# EAGLE design MultiPSU (EAGLE 7.6.0)
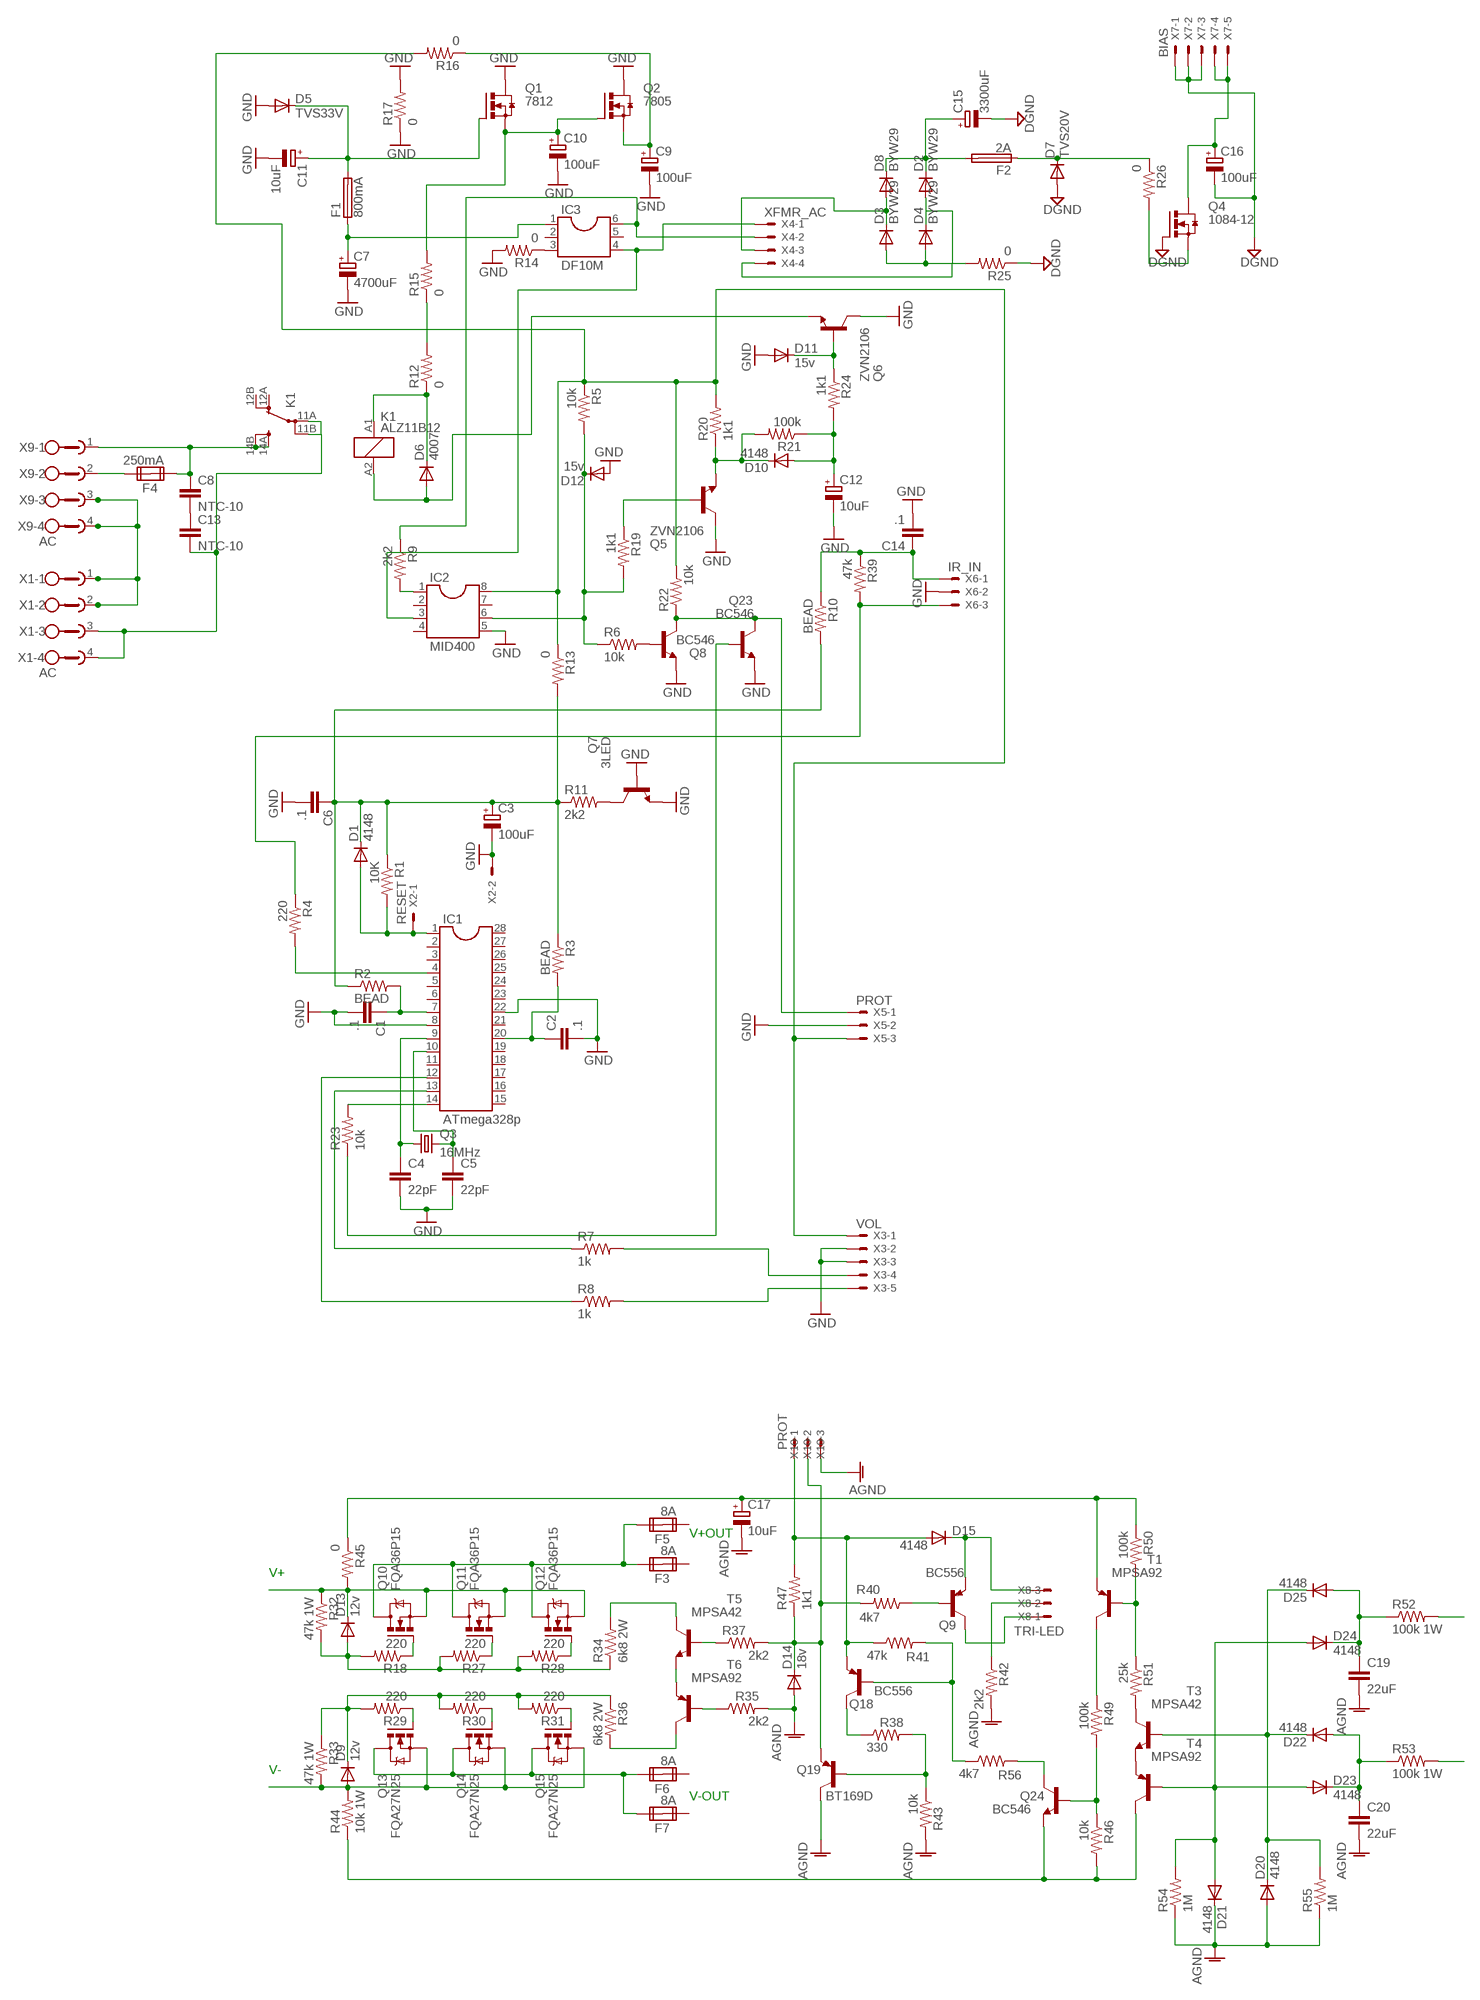
[diagram p0: schematic, sheet 1]

## Parts
C1  .1  C-EUC1210K  [C1210K]
C2  .1  C-EUC1210K  [C1210K]
C3  100uF  CPOL-EUE3.5-10  [E3,5-10]
C4  22pF  C-EUC1210K  [C1210K]
C5  22pF  C-EUC1210K  [C1210K]
C6  .1  C-EUC1210K  [C1210K]
C7  4700uF  CPOL-EUE7.5-16  [E7,5-16]
C8  NTC-10  C-EU102-054X133  [C102-054X133]
C9  100uF  CPOL-EUE3.5-10  [E3,5-10]
C10  100uF  CPOL-EUE3.5-10  [E3,5-10]
C11  10uF  CPOL-EUE3.5-10  [E3,5-10]
C12  10uF  CPOL-EUE3.5-10  [E3,5-10]
C13  NTC-10  C-EU102-054X133  [C102-054X133]
C14  .1  C-EUC1210K  [C1210K]
C15  3300uF  CPOL-EUE7.5-16  [E7,5-16]
C16  100uF  CPOL-EUE3.5-10  [E3,5-10]
C17  10uF  CPOL-EUE3.5-10  [E3,5-10]
C19  22uF  C-EU050-075X075  [C050-075X075]
C20  22uF  C-EU050-075X075  [C050-075X075]
D1  4148  1N4148DO35-7  [DO35-7]
D2  BYW29  [DO220S]
D3  BYW29  [DO220S]
D4  BYW29  [DO220S]
D5  TVS33V  BY448  [SOD57-10]
D6  4007  1N4004  [DO41-10]
D7  TVS20V  BY448  [SOD57-10]
D8  BYW29  [DO220S]
D9  12v  1N4004  [DO41-10]
D10  4148  1N4148DO35-10  [DO35-10]
D11  15v  1N4148DO35-7  [DO35-7]
D12  15v  1N4148DO35-7  [DO35-7]
D13  12v  1N4004  [DO41-10]
D14  18v  1N4004  [DO41-10]
D15  4148  1N4004  [DO41-10]
D20  4148  1N4148DO35-7  [DO35-7]
D21  4148  1N4148DO35-7  [DO35-7]
D22  4148  1N4148DO35-7  [DO35-7]
D23  4148  1N4148DO35-7  [DO35-7]
D24  4148  1N4148DO35-7  [DO35-7]
D25  4148  1N4148DO35-7  [DO35-7]
F1  800mA  19560  [19560]
F2  2A  19560  [19560]
F3  8A  FUSE2P  [FUSE1]
F4  250mA  FUSE2P  [FUSE1]
F5  8A  FUSE2P  [FUSE1]
F6  8A  FUSE2P  [FUSE1]
F7  8A  FUSE2P  [FUSE1]
IC1  ATmega328p  DIL28-3  [DIL28-3]
IC2  MID400  DIL8  [DIL08]
IC3  DF10M  DIL6  [DIL06]
K1  ALZ11B12  RT314730  [RT-C/O16A5]
Q1  7812  IRFI540NPBF  [TO220BH]
Q2  7805  IRFI540NPBF  [TO220BH]
Q3  16MHz  CRYSTALHC49S  [HC49/S]
Q4  1084-12  IRFI540NPBF  [TO220BH]
Q5  ZVN2106  BC550B  [TO92-EBC]
Q6  ZVN2106  BC550B  [TO92-EBC]
Q7  3LED  BC546A  [TO92-EBC]
Q8  BC546  BC550B  [TO92-EBC]
Q9  BC556  BC560  [TO92-EBC]
Q10  FQA36P15  IXFH_6N100  [TO-247AD-H]
Q11  FQA36P15  IXFH_6N100  [TO-247AD-H]
Q12  FQA36P15  IXFH_6N100  [TO-247AD-H]
Q13  FQA27N25  IXFH_6N100  [TO-247AD-H]
Q14  FQA27N25  IXFH_6N100  [TO-247AD-H]
Q15  FQA27N25  IXFH_6N100  [TO-247AD-H]
Q18  BC556  BC560  [TO92-EBC]
Q19  BT169D  BC560  [TO92-EBC]
Q23  BC546  BC550B  [TO92-EBC]
Q24  BC546  BC550B  [TO92-EBC]
R1  10K  R-US_0309/10  [0309/10]
R2  BEAD  R-US_0309/10  [0309/10]
R3  BEAD  R-US_0309/12  [0309/12]
R4  220  R-US_0309/12  [0309/12]
R5  10k  R-US_0309/10  [0309/10]
R6  10k  R-US_0309/12  [0309/12]
R7  1k  R-US_R1210  [R1210]
R8  1k  R-US_R1210  [R1210]
R9  2k2  R-US_0309/12  [0309/12]
R10  BEAD  R-US_0309/10  [0309/10]
R11  2k2  R-US_0309/10  [0309/10]
R12  0  R-US_0309/10  [0309/10]
R13  0  R-US_0309/12  [0309/12]
R14  0  R-US_0309/10  [0309/10]
R15  0  R-US_0309/12  [0309/12]
R16  0  R-US_0309/12  [0309/12]
R17  0  R-US_0309/12  [0309/12]
R18  220  R-US_0309/12  [0309/12]
R19  1k1  R-US_0309/12  [0309/12]
R20  1k1  R-US_0309/10  [0309/10]
R21  100k  R-US_0309/10  [0309/10]
R22  10k  R-US_0309/10  [0309/10]
R23  10k  R-US_R1210  [R1210]
R24  1k1  R-US_0309/10  [0309/10]
R25  0  R-US_0309/12  [0309/12]
R26  0  R-US_0309/12  [0309/12]
R27  220  R-US_0309/12  [0309/12]
R28  220  R-US_0309/12  [0309/12]
R29  220  R-US_0309/12  [0309/12]
R30  220  R-US_0309/12  [0309/12]
R31  220  R-US_0309/12  [0309/12]
R32  47k 1W  R-US_0411/15  [0411/15]
R33  47k 1W  R-US_0411/15  [0411/15]
R34  6k8 2W  R-US_0411/15  [0411/15]
R35  2k2  R-US_0309/10  [0309/10]
R36  6k8 2W  R-US_0411/15  [0411/15]
R37  2k2  R-US_0309/10  [0309/10]
R38  330  R-US_0309/10  [0309/10]
R39  47k  R-US_0309/10  [0309/10]
R40  4k7  R-US_0309/10  [0309/10]
R41  47k  R-US_0309/10  [0309/10]
R42  2k2  R-US_0309/10  [0309/10]
R43  10k  R-US_0309/10  [0309/10]
R44  10k 1W  R-US_0411/15  [0411/15]
R45  0  R-US_0309/12  [0309/12]
R46  10k  R-US_0411/15  [0411/15]
R47  1k1  R-US_0309/10  [0309/10]
R49  100k  R-US_0411/15  [0411/15]
R50  100k  R-US_0309/10  [0309/10]
R51  25k  R-US_0309/10  [0309/10]
R52  100k 1W  R-US_0309/10  [0309/10]
R53  100k 1W  R-US_0309/10  [0309/10]
R54  1M  R-US_R1210  [R1210]
R55  1M  R-US_R1210  [R1210]
R56  4k7  R-US_0309/10  [0309/10]
T1  MPSA92  MPSA92-PNP-TO92-EBC  [TO92-EBC]
T3  MPSA42  MPSA42-NPN-TO92-EBC  [TO92-EBC]
T4  MPSA92  MPSA92-PNP-TO92-EBC  [TO92-EBC]
T5  MPSA42  MPSA42-NPN-TO92-EBC  [TO92-EBC]
T6  MPSA92  MPSA92-PNP-TO92-EBC  [TO92-EBC]
X1  AC  GMSTBA4  [GMSTBA4]
X2  RESET  22-23-2021  [22-23-2021]
X3  VOL  22-23-2051  [22-23-2051]
X4  XFMR_AC  5566-4  [5566-4]
X5  PROT  22-23-2031  [22-23-2031]
X6  IR_IN  22-23-2031  [22-23-2031]
X7  BIAS  22-23-2051  [22-23-2051]
X8  TRI-LED  22-23-2031  [22-23-2031]
X9  AC  GMSTBA4  [GMSTBA4]
X10  PROT  22-23-2031  [22-23-2031]

## Nets
AGND: C17.- C19.2 C20.2 D14.A D20.A D21.C Q19.C R35.2 R42.2 R43.2 R54.1 R55.1 X10.3
DGND: C15.- C16.- D7.A Q4.G R25.1 X7.1 X7.2 X7.3
GND: C1.2 C2.2 C3.- C4.2 C5.2 C6.2 C7.- C9.- C10.- C11.- C12.- C14.2 D5.A D11.A D12.A IC1.8 IC1.22 IC2.5 Q1.D Q2.D Q5.C Q6.C Q7.B Q7.E Q8.E Q23.E R14.2 R17.1 R17.2 X2.2 X3.2 X3.3 X5.2 X6.2
N$1: Q8.B R6.2
N$2: D1.A IC1.1 R1.2 X2.1
N$3: IC1.4 R4.2
N$4: C2.1 IC1.20 R3.2
N$5: R4.1 R39.2 X6.3
N$7: IC1.13 R7.1
N$8: IC1.12 R8.1
N$9: C11.+ D5.C F1.2 Q1.G
N$10: C8.2 C13.1
N$11: D6.C K1.A1 R12.1
N$12: IC3.6 R9.1 X4.2
N$13: C4.1 IC1.9 Q3.1
N$14: C5.1 IC1.10 Q3.2
N$15: X1.1 X1.2 X9.3 X9.4
N$16: D12.C IC2.6 R5.2 R6.1 R19.2
N$17: IC2.1 R9.2
N$18: Q8.C Q23.C R22.1 X5.1
N$19: IC3.3 R14.1
N$20: C14.1 R10.1 R39.1 X6.1
N$21: F4.2A X9.2
N$22: Q7.C R11.2
N$24: C8.1 F4.1A K1.14A(2:SA) K1.14B(2:SB) X9.1
N$25: C13.2 K1.11A(2:PA) K1.11B(2:PB) X1.3 X1.4
N$26: C9.+ Q2.S R16.1
N$28: C10.+ Q1.S Q2.G R15.2
N$29: R12.2 R15.1
N$30: C7.+ F1.1 IC3.1
N$32: C3.+ C6.1 D1.C R1.1 R2.1 R3.1 R10.2 R11.1 R13.2
N$33: D3.C D8.A X4.3
N$34: D2.A D4.C X4.4
N$35: C1.1 IC1.7 R2.2
N$36: IC2.8 R5.1 R13.1 R16.2 R20.2 R22.2 X3.1 X5.3
N$37: IC2.3 IC3.4 X4.1
N$38: Q5.B R19.1
N$39: D10.C Q5.E R20.1 R21.2
N$40: C12.+ D10.A R21.1 R24.2
N$41: IC1.14 R23.2
N$42: D6.A K1.A2 Q6.E
N$43: D11.C Q6.B R24.1
N$44: Q23.B R23.1
N$45: R8.2 X3.5
N$46: R7.2 X3.4
N$47: D3.A D4.A R25.2
N$48: C15.+ D2.C D8.C F2.2
N$49: D7.C F2.1 R26.1
N$52: Q4.S R26.2
N$53: D13.C Q10.S Q11.S Q12.S R32.1 R45.2
N$54: F3.2A F5.2A Q10.D Q11.D Q12.D
N$55: D9.A Q13.S Q14.S Q15.S R33.2 R44.2
N$56: C16.+ Q4.D X7.4 X7.5
N$57: F6.2A F7.2A Q13.D Q14.D Q15.D
N$58: Q10.G R18.1
N$59: Q11.G R27.1
N$60: Q12.G R28.1
N$61: Q13.G R29.1
N$62: Q14.G R30.1
N$63: Q15.G R31.1
N$64: D9.C R29.2 R30.2 R31.2 R33.1 R36.1
N$65: D13.A R18.2 R27.2 R28.2 R32.2 R34.1
N$70: R34.2 T5.C
N$71: R36.2 T6.C
N$72: T5.E T6.E
N$73: R35.1 T6.B
N$74: R37.1 T5.B
N$75: Q18.C R38.1
N$76: D14.C Q19.E R37.2 R40.2 R47.1 X10.2
N$77: Q9.B R40.1
N$78: R42.1 X8.2
N$79: Q19.B R38.2 R43.1
N$80: Q9.C X8.1
N$81: D15.C Q9.E X8.3
N$89: Q24.E R44.1 R46.2 T4.C
N$90: R49.1 T1.C
N$91: Q24.B R46.1 R49.2
N$92: C17.+ R45.1 R50.1 T1.E
N$93: Q18.B R41.2 R56.1
N$94: R50.2 R51.1 T1.B
N$95: R51.2 T3.C
N$96: T3.E T4.E
N$98: D21.A D23.A D24.A R54.2 T4.B
N$99: D20.C D22.C D25.C R55.2 T3.B
N$100: C20.1 D22.A D23.C R53.1
N$101: C19.1 D24.C D25.A R52.1
N$103: R52.2
N$106: R53.2
N$108: Q24.C R56.2
N$109: D15.A Q18.E R41.1 R47.2 X10.1
Unconnected: F3.1A F3.1B F3.2B F4.1B F4.2B F5.1A F5.1B F5.2B F6.1A F6.1B F6.2B F7.1A F7.1B F7.2B IC1.2 IC1.3 IC1.5 IC1.6 IC1.11 IC1.15 IC1.16 IC1.17 IC1.18 IC1.19 IC1.21 IC1.23 IC1.24 IC1.25 IC1.26 IC1.27 IC1.28 IC2.2 IC2.4 IC2.7 IC3.2 IC3.5 K1.12A(2:OA) K1.12B(2:OB)

## Notes on the sheet
- V+OUT
- V+
- V-
- V-OUT

## Library data of the parts
C1 C2 C4-C6 C8 C13 C14 C19 C20 = resistor:C-EU: CAPACITOR, European symbol
C3 C7 C9-C12 C15-C17 = resistor:CPOL-EU: POLARIZED CAPACITOR, European symbol
D1 D10-D12 D20-D25 = diode:1N4148: DIODE high speed (Philips)
D2-D4 D8 = diode:BYW29: DIODE ultra fast rectifier, 200 V, 8 A
D5 D7 = diode:BY448: DIODE damper diode
D6 D9 D13-D15 = diode:1N4004: DIODE general purpose rectifier, 1 A
F1 F2 = fuse:19560: FUSE HOLDER TR5, Wickmann; MPN: 56000001009; OC_FARNELL: 1185363; OC_NEWARK: 15P8392
F3-F7 = special:FUSE2P: FUSE 5 x 20 mm
IC1 = ic-package:DIL28: Dual In Line
IC2 = ic-package:DIL8: Dual In Line / Socket
IC3 = ic-package:DIL6: Dual In Line / Socket
K1 = relay:RT31*: Power PCB Relayl SCHRACK 1 pole 12 / 16 A, DC- or AC-coi Source: http://www.schrack.com/.. 5819.pdf; MPN: RT314730; OC_FARNELL: 1629051; OC_NEWARK: 03P2424
Q1 Q2 Q4 = transistor-power:IRFI540NPBF: HEXFET Power MOISFET VDSS = 100V, RDS(on) = 0.052 Ohm, ID = 20A, VGS(th) = 2.0 -- 4.0V Source: http://www.irf.com/product-info/datasheets/data/irfi540npbf.pdf
Q3 = crystal:CRYSTAL: CRYSTAL; OC_FARNELL: 1667008; OC_NEWARK: unknown
Q5 Q6 Q8 Q23 Q24 = transistor-npn:BC550*: NPN Transistor
Q7 = transistor-npn:BC546*: NPN Transistor
Q9 Q18 Q19 = transistor-pnp:BC560*: PNP Transistror
Q10-Q15 = transistor-power:IXF?6N*: HiPerFET (TM) Power MOSFET N-Channel Enhancement Mode HDMOS Family Source: http://www.ixys.com/91529.pdf
R1-R47 R49-R56 = resistor:R-US_: RESISTOR, American symbol
T1 T4 T6 = transistor:*-PNP-: PNP Transistror
T3 T5 = transistor:*-NPN-: NPN Transistror BF959 corrected 2008.03.06
X1 X9 = con-phoenix-762:GMSTBA4: PHOENIX; MF: FARNELL; MPN: 1757268; OC_FARNELL: 3705195; OC_NEWARK: 71C4163
X2 = con-molex:22-23-2021: .100" (2.54mm) Center Header - 2 Pin; MF: MOLEX; MPN: 22-23-2021; OC_FARNELL: 1462926; OC_NEWARK: 25C3832
X3 X7 = con-molex:22-23-2051: .100" (2.54mm) Center Header - 5 Pin; MF: MOLEX; MPN: 22-23-2051; OC_FARNELL: 1462952; OC_NEWARK: 38C9178
X4 = con-molex:5566-4: Mini FIT connector 4 pol Source: http://www.molex.com; OC_FARNELL: unknown; OC_NEWARK: unknown
X5 X6 X8 X10 = con-molex:22-23-2031: .100" (2.54mm) Center Header - 3 Pin; MF: MOLEX; MPN: 22-23-2031; OC_FARNELL: 1462950; OC_NEWARK: 30C0862

## Board
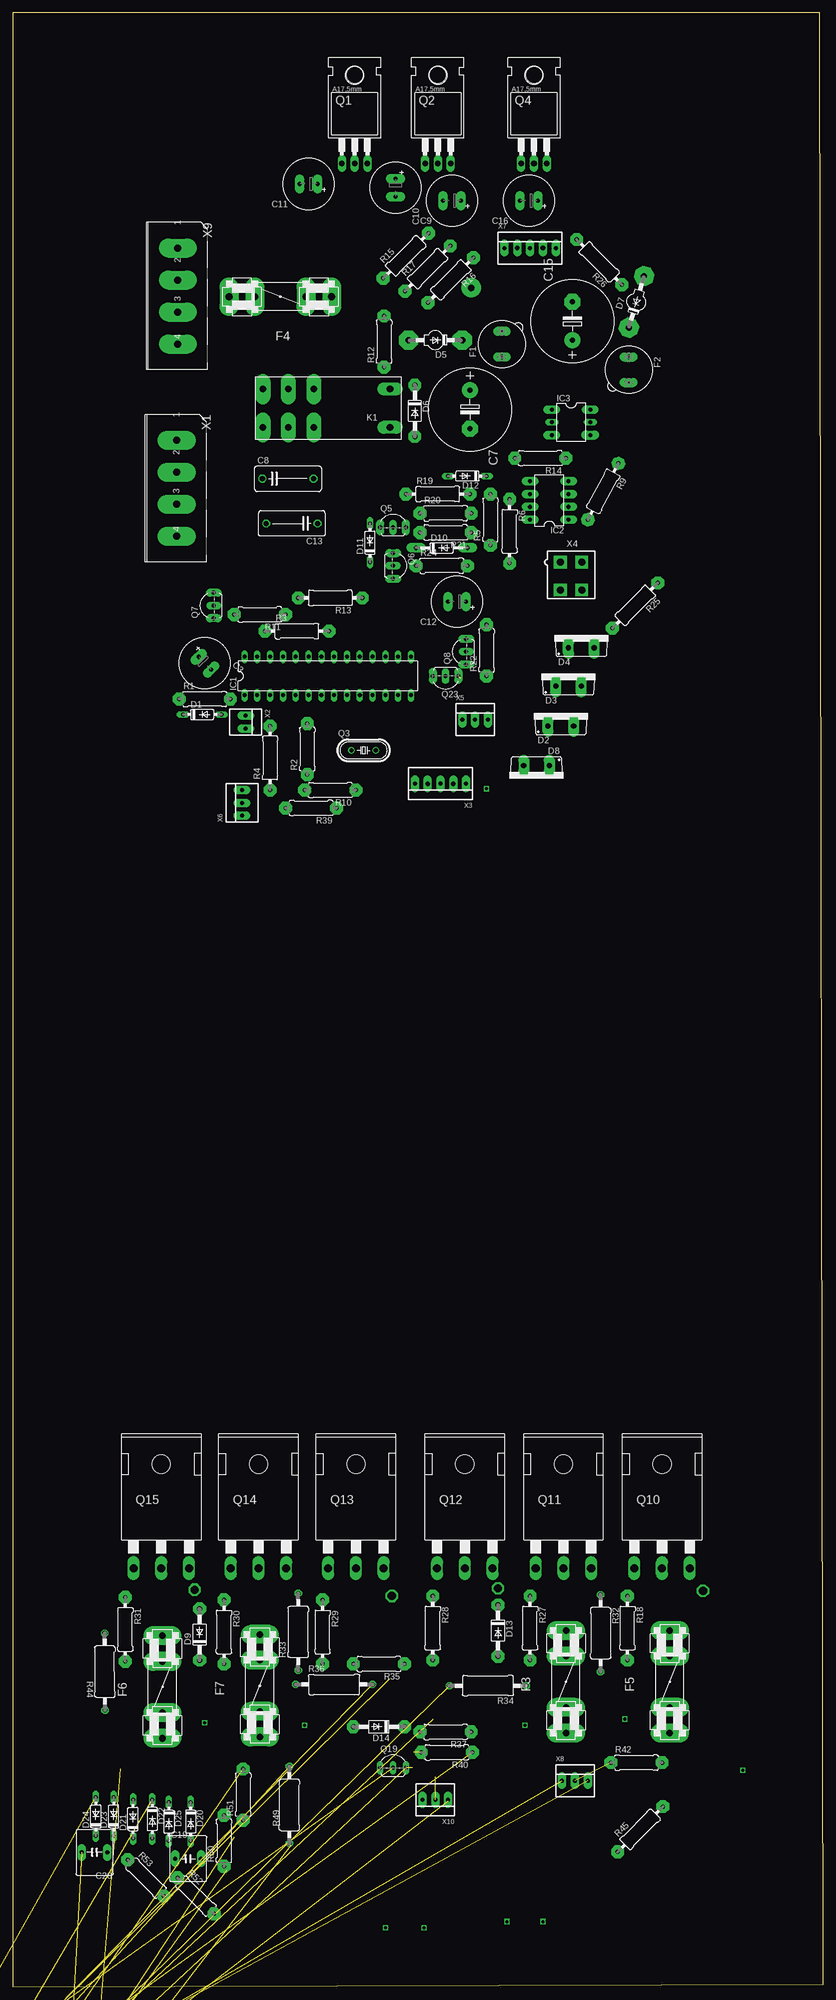
[diagram p1: board, top side]
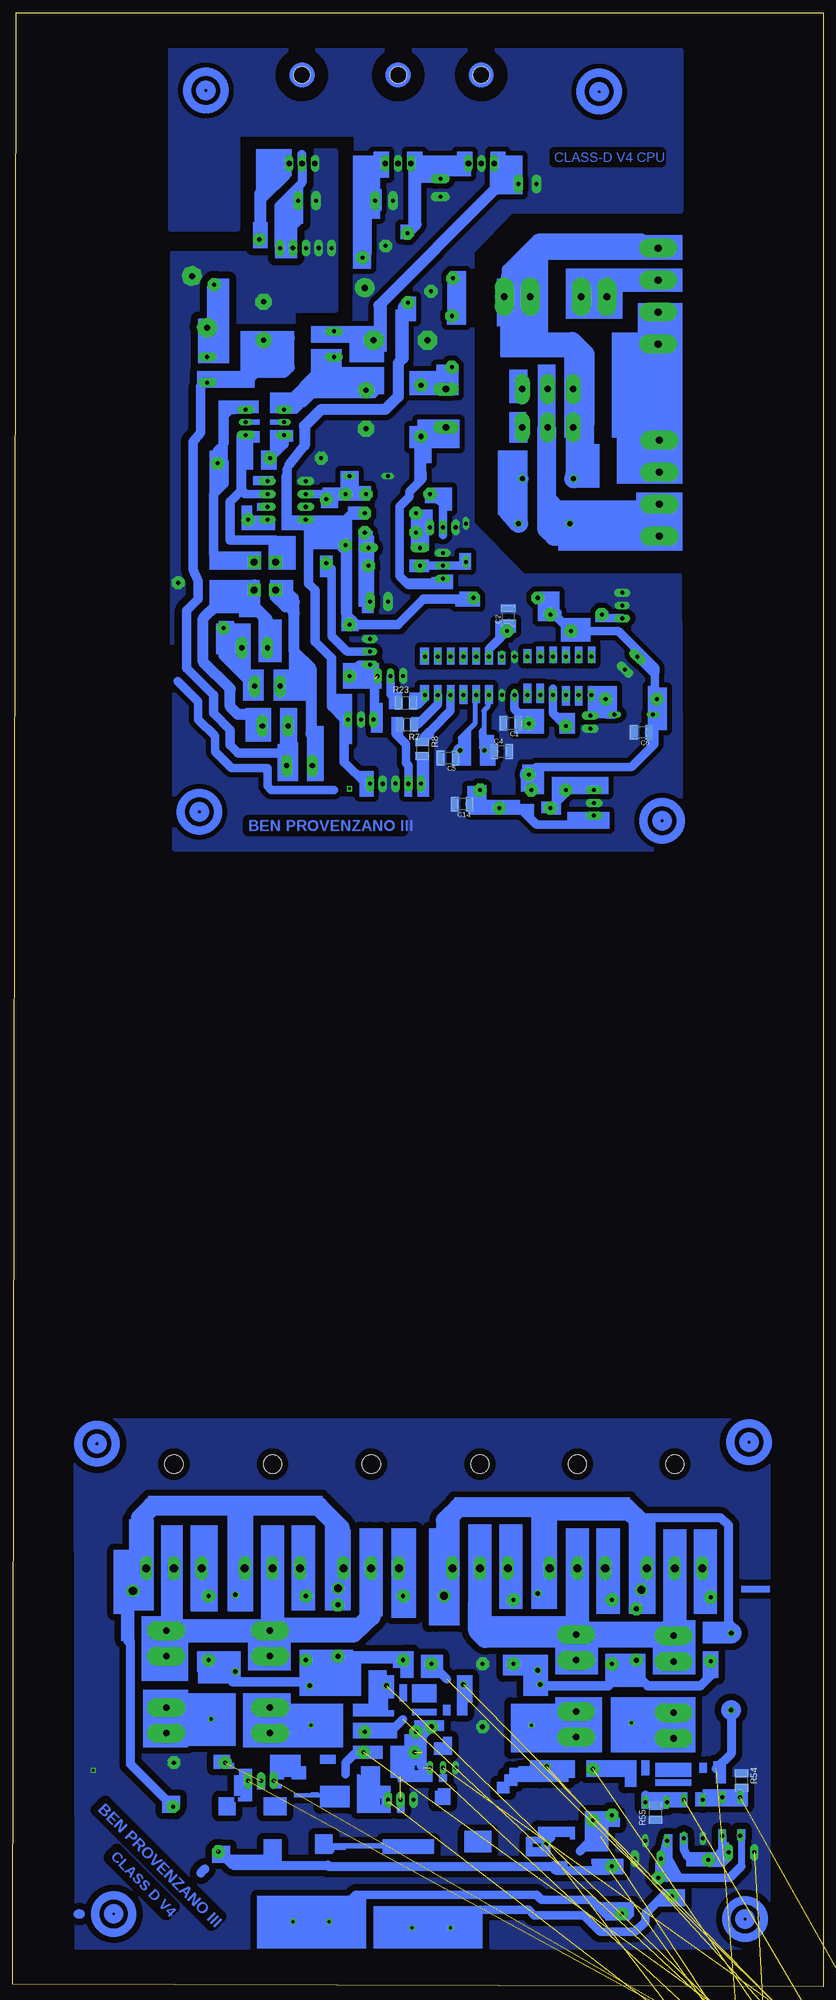
[diagram p2: board, bottom side, seen from below]

Size 160.76 x 391.34 mm. Coordinates in mm from the lower left corner, seen from the top.
Outline: 0,0 160.76,0.51 160,391.34 0,391.34 0,0
Copper layers (1*16): Top 0.035mm / dielectric 1.5mm / Bottom 0.035mm
Design rules "default": minimum track width 10mil, minimum drill 24mil, track to track 8mil, track to pad 8mil, pad to pad 8mil, via to via 8mil, smd to smd 8mil, copper to edge 40mil, drill to drill 8mil, minimum pad ring 10mil, minimum via ring 8mil, stop-mask expansion 4mil, vias tented up to drill 0mil, thermal gap 10mil

### Footprints (pad centres in the part's own frame; a part is rotated, then mirrored left to right if it is on the bottom)
C1210K = smd 1.5 x 2.9: 1 -1.5,0; 2 1.5,0
E3,5-10 = drill 0.813 pad 1.93 long: + -1.778,0; - 1.778,0
E7,5-16 = drill 1.016 pad 3.15: + -3.81,0 | drill 1.016 pad 3.15 octagon: - 3.81,0
C102-054X133 = drill 1.016 octagon: 1 -5.08,0; 2 5.08,0
C050-075X075 = drill 0.813 pad 1.676 long: 1 -2.54,0; 2 2.54,0
DO35-7 = drill 0.813 long: A 3.81,0; C -3.81,0
DO220S = drill 1.016 pad 2.184 long: A 2.54,-2.54; C -2.54,-2.54
SOD57-10 = drill 1.194 pad 3.81 octagon: A 5.334,0; C -5.334,0
DO41-10 = drill 1 pad 2.54 octagon: A 5.08,0; C -5.08,0
DO35-10 = drill 0.813 pad 1.93 long: A 5.08,0; C -5.08,0
19560 = drill 0.813 pad 1.778 long: 1 -2.54,0; 2 2.54,0
FUSE1 = drill 1.3 pad 3.81 long: 1A -10.16,0; 1B -5.08,0; 2A 10.16,0; 2B 5.08,0
DIL28-3 = drill 0.813 long: 1 -16.51,-3.81; 2 -13.97,-3.81; 3 -11.43,-3.81; 4 -8.89,-3.81; 5 -6.35,-3.81; 6 -3.81,-3.81; 7 -1.27,-3.81; 8 1.27,-3.81; 9 3.81,-3.81; 10 6.35,-3.81; 11 8.89,-3.81; 12 11.43,-3.81; 13 13.97,-3.81; 14 16.51,-3.81; 15 16.51,3.81; 16 13.97,3.81; 17 11.43,3.81; 18 8.89,3.81; 19 6.35,3.81; 20 3.81,3.81; 21 1.27,3.81; 22 -1.27,3.81; 23 -3.81,3.81; 24 -6.35,3.81; 25 -8.89,3.81; 26 -11.43,3.81; 27 -13.97,3.81; 28 -16.51,3.81
DIL08 = drill 0.813 pad 1.676 long: 1 -3.81,-3.81; 2 -1.27,-3.81; 3 1.27,-3.81; 4 3.81,-3.81; 5 3.81,3.81; 6 1.27,3.81; 7 -1.27,3.81; 8 -3.81,3.81
DIL06 = drill 0.813 pad 1.676 long: 1 -2.54,-3.81; 3 2.54,-3.81; 6 -2.54,3.81 | drill 0.813 long: 2 0,-3.81; 5 0,3.81 | drill 0.813 pad 1.778 long: 4 2.54,3.81
RT-C/O16A5 = drill 1.3 pad 3 long: 11A 7.56,3.78; 11B 7.56,-3.78; 12A 2.52,3.78; 12B 2.52,-3.78; 14A 12.6,3.78; 14B 12.6,-3.78 | drill 1.3 pad 2.54 long: A1 -12.6,-3.78; A2 -12.6,3.78
TO220BH = drill 1.118 long: D 0,-6.35; G -2.54,-6.35; S 2.54,-6.35 | hole 3.302: 0,11.176
HC49/S = drill 0.813: 1 -2.413,0; 2 2.413,0
TO92-EBC = drill 0.813 pad 1.524 long: B 0,-1.27 | drill 0.813 pad 1.6 long: C -2.54,-1.27; E 2.54,-1.27
TO92-EBC' = drill 0.813 long: B 0,-1.27; C -2.54,-1.27; E 2.54,-1.27
TO-247AD-H = drill 1.6 long: D 0,-20.65; G -5.5,-20.65; S 5.5,-20.65 | hole 3.65: 0,0
0309/10 = drill 0.813 pad 2.54 octagon: 1 -5.08,0; 2 5.08,0
0309/12 = drill 0.813 pad 2.54 octagon: 1 -6.35,0; 2 6.35,0
R1210 = smd 1.6 x 2.7: 1 -1.4,0; 2 1.4,0
0411/15 = drill 0.914 octagon: 1 -7.62,0; 2 7.62,0
TO92-EBC'' = drill 0.813 long: B 0,-1.27; C 2.54,-1.27; E -2.54,-1.27
GMSTBA4 = drill 1.397 pad 3.81 long: 1 -8.89,5.08; 2 -2.54,5.08; 3 3.81,5.08; 4 10.16,5.08
22-23-2021 = drill 0.8 pad 1.676 long: 1 -1.27,0; 2 1.27,0
22-23-2051 = drill 0.8 pad 1.676 long: 1 -5.08,0; 3 0,0; 5 5.08,0 | drill 0.9 pad 1.676 long: 2 -2.54,0; 4 2.54,0
5566-4 = drill 1.4 pad 2.54 square: 1 2.1,-2.75; 2 -2.1,-2.75; 3 2.1,2.75; 4 -2.1,2.75
22-23-2031 = drill 0.8 pad 1.676 long: 1 -2.54,0; 2 0,0; 3 2.54,0

### Placement (x,y rotation side)
C1  61.98,250.44 180 bottom
C2  62.48,271.78 90 bottom
C3  38.1,262.38 314.6 top
C4  63.75,244.86 0 bottom
C5  74.42,243.59 180 bottom
C6  36.07,248.67 180 bottom
C7  90.68,312.67 270 top
C8  54.61,298.96 0 top
C9  87.12,354.08 180 top
C10  75.95,356.62 270 top
C11  58.67,357.38 180 top
C12  88.14,274.57 180 top
C13  55.37,290.07 180 top
C14  71.63,234.44 180 bottom
C15  111,330.2 90 top
C16  102.36,354.08 180 top
C17  -63.75,-86.61 0 top  (outside the outline)
C19  34.8,25.4 0 top
C20  16.26,26.67 180 top
D1  37.59,252.22 0 top
D2  108.71,252.48 0 top
D3  110.24,260.35 0 top
D4  112.78,267.97 0 top
D5  83.82,326.39 180 top
D6  79.76,312.42 270 top
D7  123.7,334.01 73.6 top
D8  103.89,239.52 180 top
D9  37.08,69.85 90 top
D10  85.09,285.24 0 top
D11  70.87,286.26 90 top
D12  90.17,299.47 180 top
D13  96.27,70.61 270 top
D14  72.64,51.56 180 top
D15  6.6,-20.57 0 top  (outside the outline)
D20  35.31,32.77 270 top
D21  23.88,33.27 90 top
D22  27.69,33.27 270 top
D23  20.07,33.78 90 top
D24  16.51,33.78 90 top
D25  30.99,32.77 270 top
F1  97.03,325.63 90 top
F2  122.17,320.55 270 top
F3  109.73,60.45 90 top
F4  53.09,335.03 180 top
F5  130.3,60.45 90 top
F6  29.72,59.44 90 top
F7  49.02,59.69 90 top
IC1  62.48,259.84 0 top
IC2  106.43,294.64 90 top
IC3  110.74,310.13 270 top
K1  62.23,312.93 180 top
Q1  67.82,367.79 0 top
Q2  84.33,367.79 0 top
Q3  69.6,245.11 0 top
Q4  103.38,367.79 0 top
Q5  75.44,290.58 0 top
Q6  76.71,281.69 270 top
Q7  38.61,273.81 90 top
Q8  88.65,264.67 90 top
Q9  BC556  [TO92-EBC']  -30.99,-40.13 0 top  (outside the outline)
Q10  128.78,103.63 0 top
Q11  109.22,103.63 0 top
Q12  89.66,103.63 0 top
Q13  68.07,103.63 0 top
Q14  48.77,103.63 0 top
Q15  29.46,103.63 0 top
Q18  BC556  [TO92-EBC']  -22.35,-40.13 0 top  (outside the outline)
Q19  BT169D  [TO92-EBC']  75.44,44.7 0 top
Q23  85.85,258.57 180 top
Q24  -13.72,-40.13 0 top  (outside the outline)
R1  38.1,255.27 0 top
R2  58.42,245.36 90 top
R3  56.39,268.73 0 top
R4  51.05,243.59 90 top
R5  94.74,290.83 90 top
R6  98.55,288.54 270 top
R7  82.55,250.19 180 bottom
R8  79.5,245.36 270 bottom
R9  117.09,296.42 241.6 top
R10  62.99,237.24 180 top
R11  49.02,272.03 180 top
R12  73.66,326.14 90 top
R13  62.99,275.34 180 top
R14  104.65,303.02 180 top
R15  77.98,343.15 44.8 top
R16  86.87,338.33 224.6 top
R17  82.3,340.61 45 top
R18  121.92,71.12 270 top
R19  84.33,295.91 0 top
R20  85.85,292.1 0 top
R21  85.85,288.29 180 top
R22  93.98,264.92 90 top
R23  82.8,254.51 0 bottom
R24  85.09,281.69 0 top
R25  123.44,273.81 225 top
R26  116.33,341.88 135 top
R27  102.62,71.12 270 top
R28  83.31,71.12 270 top
R29  61.47,70.36 270 top
R30  41.91,70.36 270 top
R31  22.35,70.87 270 top
R32  116.59,70.1 270 top
R33  56.64,70.36 90 top
R34  94.23,59.69 180 top
R35  72.64,64.01 180 top
R36  63.75,59.94 0 top
R37  85.85,50.55 180 top
R38  -2.03,-33.02 0 top  (outside the outline)
R39  59.18,233.68 180 top
R40  86.11,46.48 180 top
R41  -62.48,-95.5 0 top  (outside the outline)
R42  123.7,44.45 0 top
R43  6.6,-9.14 0 top  (outside the outline)
R44  18.29,62.48 90.2 top
R45  124.46,31.24 45 top
R46  8.89,-14.99 0 top  (outside the outline)
R47  6.6,-27.69 0 top  (outside the outline)
R49  54.87,36.07 90 top
R50  41.91,28.96 90 top
R51  45.72,38.1 90 top
R52  36.32,18.03 315.4 top
R53  26.42,21.59 315 top
R54  16.26,40.89 270 bottom
R55  33.27,34.54 90 bottom
R56  -2.03,-43.69 0 top  (outside the outline)
T1  MPSA92  [TO92-EBC'']  -14.48,-58.17 0 top  (outside the outline)
T3  MPSA42  [TO92-EBC'']  -39.62,-76.2 0 top  (outside the outline)
T4  MPSA92  [TO92-EBC'']  -48.26,-76.2 0 top  (outside the outline)
T5  MPSA42  [TO92-EBC'']  -56.9,-76.2 0 top  (outside the outline)
T6  MPSA92  [TO92-EBC'']  -65.53,-76.2 0 top  (outside the outline)
X1  27.43,297.69 270 top
X2  46.23,250.7 270 top
X3  84.84,238.51 180 top
X4  110.74,279.65 180 top
X5  91.69,251.21 0 top
X6  45.47,234.7 90 top
X7  102.62,344.68 0 top
X8  111.51,40.89 0 top
X9  27.69,335.79 270 top
X10  83.82,37.08 180 top

### Tracks (layer width: path | path; a pad name or v marks a point on that pad's centre or on a via)
AGND  (via drill 0.6)  (2 unrouted)
  other vias: 144.78,42.93
  pour Bottom (isolate 1.27, no thermals): 10.67,112.52 148.59,112.52 148.34,7.62 10.67,7.62
DGND
  pour Bottom (isolate 1.422, no thermals): 104.65,266.19 129.03,266.19 129.03,343.66 113.03,343.66 113.03,363.98 96.77,363.98 96.77,332.23 105.16,332.23 105.16,322.07 107.7,318.77 116.84,318.77 118.87,312.93 118.87,286.51 110.49,284.73 113.79,277.37 106.17,272.54 105.66,267.21
GND  (via drill 1.3 pad 3.81)
  other vias: 90.93,336.8
  pour Bottom (isolate 1.016, no thermals): 28.45,279.65 59.44,279.65 69.6,290.07 69.6,343.92 61.72,352.04 28.19,352.04 28.19,383.79 129.54,383.79 129.54,348.49 116.08,348.49 116.08,367.28 92.71,367.28 92.96,328.68 107.7,316.48 107.95,315.72 110.74,263.14 128.78,263.14 128.78,225.55 28.19,225.55
N$1
  Bottom 1.676: Q8.B 94.49,264.67 97.54,267.72 97.54,281.18 R6.2
N$2
  Bottom 1.676: R1.2 43.94,256.03 45.21,256.03 | 45.21,256.03 IC1.1 | X2.1 45.21,252.48 45.21,254.51 | 45.21,254.51 45.21,256.03 | D1.A 42.93,252.22 45.21,254.51
N$3
  Bottom 1.676: R4.2 53.59,252.48 IC1.4 53.59,257.3
N$4
  Bottom 1.676: 66.29,262.89 IC1.20 66.29,265.18 R3.2 C2.1
N$5
  Bottom 1.676: R39.2 50.93,236.86 | 50.93,236.86 50.55,237.24 X6.3 | R4.1 50.93,237.11 50.93,236.86
N$6
  Bottom 1.676: 33.53,255.78 33.53,256.03
N$7
  Bottom 1.676: IC1.13 76.45,254.25 80.52,250.19 R7.1
N$8
  Bottom 1.422: 77.72,249.17 77.98,248.92
  Bottom 1.676: IC1.12 73.91,252.98 77.72,249.17 | 79.25,247.65 77.98,248.92 77.98,248.29 R8.1
N$9
  Bottom 1.676: F1.2 89.15,327.91 88.39,327.91 88.14,327.66 | C11.+ 64.77,357.89 65.28,358.39 Q1.G 65.28,356.11 | D5.C 89.15,326.9
  Bottom 2.184: 65.28,356.11 88.14,333.25 88.14,327.66 | 88.65,326.9 89.15,326.9 89.15,327.91
N$10
  Bottom 1.676: 62.99,297.69 62.48,297.18 62.48,292.35
  Bottom 2.54: C8.2 62.99,297.69
  Bottom 3.81: 62.48,292.35 C13.1
N$11
  Bottom 1.676: 79.76,319.02 D6.C 75.11,316.99 K1.A1 74.83,319.89 R12.1
N$12
  Bottom 1.676: 116.59,312.67 IC3.6
  Bottom 1.778: R9.1 120.11,304.57 118.87,305.82 118.87,311.4 117.6,312.67 116.59,312.67
  Bottom 1.93: 118.87,299.47 118.87,302.26 119.13,302 R9.1 118.87,300.25 118.87,297.94 120.9,295.91 120.9,283.97 119.34,282.4 X4.2 112.78,282.4 112.78,283.46
N$13
  Bottom 1.016: IC1.9 66.55,255.78 66.55,253.75 67.31,252.98 67.31,249.43 67.82,248.92 67.82,245.75 Q3.1
  Bottom 1.676: 67.31,245.39 C4.1 67.03,244.96 Q3.1
N$14
  Bottom 1.016: IC1.10 69.09,256.03 69.09,250.44 71.99,247.55 71.99,244.61 | 70.36,246.76 Q3.2 | C5.1 71.97,242.88 71.97,244.1
  Bottom 1.676: Q3.2 71.99,244.61 71.97,244.1
N$15
  Bottom 1.676: X9.3 X9.4 | X9.4 32.51,323.6 32.77,323.34 X9.4 | X1.2 X1.1 X9.4
N$16
  Bottom 1.676: R19.2 R5.2 | R5.2 98.55,295.91 IC2.6 | D12.C 94.74,299.21 R5.2
  Bottom 1.93: R6.1 98.55,295.91
N$17
  Bottom 1.676: IC2.1 R9.2
N$18  (1 unrouted)
  Bottom 1.676: 92.34,261.71 R22.1 93.73,259.33 88.9,259.33 88.9,251.46 X5.1 | 92.34,261.71 92.2,261.87 | Q8.C 91.93,262.13 92.34,261.71
N$19
  Bottom 1.93: IC3.3 106.93,305.82 R14.1
N$20
  Bottom 1.676: 68.07,234.44 65.02,234.44 R39.1 60.2,233.68 56.9,230.38 46.74,230.38 X6.1 | 68.07,234.44 C14.1 | R10.1 68.07,234.44
N$21
  Bottom 3.81: F4.2A 43.94,335.03 | 48.01,335.03 43.94,335.03 | 43.94,335.03 40.64,338.33 X9.2
N$22
  Bottom 1.676: Q7.C 43.94,271.27 R11.2
N$24
  Bottom 1.676: 47.24,309.88 46.33,310.49 49.07,309.38 K1.14A | K1.14B 46.23,318.39 46.23,318.26 47.24,321.56
  Bottom 2.54: 34.54,344.93 35.81,346.2 56.64,346.2 62.48,340.36 F4.1A
  Bottom 3.81: X9.1 34.54,344.93 | 58.67,340.61 58.67,335.28 | 58.67,335.28 58.67,329.44 55.37,326.14 49.78,326.14 47.24,323.6 47.24,321.56 47.24,309.88 | F4.1A 62.23,335.28 58.67,335.28 | C8.1 47.5,303.02 47.5,308.61 48.77,309.88 49.28,309.88 49.07,309.68 49.07,309.38
N$25
  Bottom 2.184: K1.11B K1.11A 54.86,311.63 54.86,308.86
  Bottom 2.54: X1.3 X1.4
  Bottom 3.81: 54.86,308.86 54.86,294.89 | 54.86,294.89 54.86,289.05 53.34,287.53 X1.4 | C13.2 54.86,294.89
N$26
  Bottom 1.676: Q2.S 90.42,357.89 90.42,354.33 | 90.42,354.33 90.42,343.66 91.3,342.79 R16.1 | C9.+ 88.9,354.33 90.42,354.33
N$28
  Bottom 1.676: Q1.S 75.95,361.44 | 75.95,361.44 76.71,361.44 Q2.G | C10.+ 75.95,361.44
  Bottom 2.184: R15.2 80.77,349.34 80.77,359.16 78.49,361.44 76.71,361.44
N$29
  Bottom 2.184: R12.2 73.47,331.4 R15.1
N$30
  Bottom 1.676: 103.89,316.48 C7.+ 91.44,316.74 88.14,316.74 89.15,315.72 101.35,315.72 103.12,313.94 | 105.03,315.34 103.89,316.48 | 103.12,317.25 97.79,322.58 F1.1 | 103.89,316.48 103.12,317.25 | 103.12,317.25 101.85,317.25 | 101.85,317.25 101.6,317.5 | 101.85,317.25 104.9,314.2 106.93,314.2 IC3.1 | IC3.1 105.66,315.21 104.65,315.21 | IC3.1 104.65,312.67 103.12,314.2
N$32
  Bottom 1.676: R10.2 R2.1 56.9,241.81 38.1,241.81 33.53,246.38 33.53,248.41 | 33.53,248.41 33.53,254.76 | 33.53,254.76 33.4,254.89 | C6.1 33.78,248.67 33.53,248.41 | D1.C 33.78,254.51 33.53,254.76 | 33.4,254.89 R1.1 | 33.4,254.89 33.4,260.2 C3.+ 33.55,260.35 33.53,260.35 33.27,260.6 33.27,261.37 40.64,268.73 R3.1 52.7,271.4 | 52.7,271.4 53.34,272.03 R11.1 | R13.2 52.7,272.42 52.7,271.4
N$33
  Bottom 1.93: 104.9,274.57 104.9,275.34 106.43,276.86 107.95,276.86 107.99,276.9 X4.3
  Bottom 2.184: D8.A 100.84,243.84 100.84,247.65 101.6,248.41 101.6,261.37 104.9,264.67 | 104.9,264.67 104.9,272.29 | 104.9,272.29 104.9,274.57 | 108.64,276.79 X4.3 | 104.9,272.29 105.66,273.56 106.68,273.56 108.71,275.59 108.71,276.86 | 104.9,264.67 104.9,260.6 D3.C
N$34
  Bottom 2.184: X4.4 112.78,276.46 | 112.78,276.46 112.78,277.88 | 112.78,276.46 112.78,273.56 110.24,271.02 110.24,270.76 | D2.A 113.54,252.22 116.08,252.22 117.6,253.75 117.6,257.3 122.94,262.64 122.94,271.27 120.4,273.81 113.28,273.81 110.24,270.76 | D4.C 110.24,270.76
N$35
  Bottom 1.676: C1.1 R2.2 | 56.62,250.44 R2.2 | R2.2 61.21,253.24 IC1.7
N$36
  Bottom 1.676: R20.2 93.47,292.1 94.74,290.83 IC2.8 | R5.1 94.74,290.32 102.11,290.32 103.89,290.32 104.14,290.07 104.14,289.81 105.66,289.81 106.43,290.58 106.43,300.74 105.92,301.75 105.66,302.01 | R22.2 93.34,270.89 | X3.1 90.68,238.51 | X5.3 94.49,250.95 95,250.95
  Bottom 1.778: 94.74,290.83 94.74,290.32
  Bottom 1.93: R13.1 69.6,275.08 79.25,275.08 84.33,270 92.46,270 93.34,270.89 94.74,272.29 94.74,284.48 96.01,285.75 R5.1 | 102.87,305.56 105.92,301.75 | 90.68,238.51 95,242.82 95,250.95 95,251.21 97.54,253.75 97.54,263.4 100.84,266.7 100.84,276.86 102.11,278.13 102.11,290.32
  Bottom 2.184: R16.2 83.31,332.9 83.31,322.83 84.33,321.82 84.33,315.21 86.87,312.67 99.57,312.67 102.87,309.37 102.87,305.56
N$37
  Bottom 1.676: IC2.3 114.81,295.91 114.81,296.16 115.06,296.42 | IC3.4 115.06,307.34 115.06,307.59 115.32,307.59
  Bottom 1.93: 115.32,296.67 117.6,294.39 117.6,286.77 108.64,286.77 X4.1 | 115.32,296.67 115.32,307.59 | 115.06,296.42 115.32,296.67
N$38
  Bottom 1.676: 75.44,287.78 Q5.B 75.44,294.13 R19.1
N$39
  Bottom 1.676: R20.1 80.77,289.56 | 80.77,289.56 R21.2 80.77,286 D10.C | Q5.E 78.23,289.56 80.77,289.56
N$40
  Bottom 1.676: R21.1 89.92,287.27 89.92,285.5 | 89.92,285.5 89.92,281.69 | 89.92,281.69 C12.+ | R24.2 89.92,281.69 | D10.A 89.92,285.5
N$41
  Bottom 1.422: 81.03,254 80.26,254 78.99,255.27 IC1.14
  Bottom 1.676: 81.03,254 81.4,254.38 R23.2
N$42
  Bottom 1.676: Q6.E 76.71,277.88 82.3,277.88 84.07,279.65 84.07,293.37 82.04,295.4 82.04,296.42 79.5,298.96 D6.A | D6.A 78.49,309.37 74.42,309.63 74.45,309.15 K1.A2 | 78.99,305.56 D6.A
N$43
  Bottom 1.676: R24.1 Q6.B 71.63,281.69 D11.C
N$44
  Bottom 1.676: R23.1 84.2,254.64 85.85,256.29 Q23.B
N$45
  Bottom 1.676: X3.5 79.76,243.96 R8.2
N$46
  Bottom 1.676: X3.4 82.3,242.06 82.8,242.57 82.8,246.38 84.84,248.41 84.84,250.7 84.58,250.95 84.58,250.82 R7.2
N$47
  Bottom 2.184: R25.2 115.32,265.86 D4.A 117.09,267.21 119.13,267.21 118.87,266.95 118.87,263.91 D3.A
N$48
  Bottom 1.676: 107.19,245.11 107.16,245.08 106.22,245.08
  Bottom 1.93: D2.C 106.17,244.6 116.08,244.6 117.6,246.13 117.6,249.17 120.9,252.48 120.9,256.03 126.24,261.37 126.24,272.8 123.95,275.08 123.95,278.64 124.97,280.92 124.97,306.32 123.44,308.1 123.44,317.25 121.67,318.77 F2.2 117.6,318.52
  Bottom 2.184: D8.C 106.22,245.08 106.17,245.87 D2.C | C15.+ 109.85,326.26 | 109.85,326.26 109.98,326.39 | 117.6,318.52 114.3,318.52 112.52,320.04 106.93,320.04 105.92,321.06 105.92,326.9 107.06,326.77 109.85,326.26
N$49
  Bottom 1.93: F2.1 122.17,327.91 D7.C 121.92,329.69 120.9,330.71 120.9,336.55 R26.1
N$50
  Bottom 1.676: 97.03,237.24 109.47,237.24 110.24,238 110.24,241.55 117.35,241.55 120.65,244.86 120.65,247.9 123.95,251.21 123.95,254.76 128.02,258.83
N$51  (via drill 0.6)
  other vias: 93.98,237.49
N$52
  Bottom 1.676: Q4.S 106.43,360.93 106.43,359.16 111.25,354.33 111.25,349.25 111.84,349.25
  Bottom 1.93: 111.84,355.52 111.84,349.25 R26.2
N$53  (via drill 1.6)
  Bottom 1.778: v136.91,78.49 136.14,76.45 137.41,75.18 137.41,68.07 137.92,68.58 137.92,69.09 137.41,68.58 137.41,44.2 131.24,38.02 R45.2
  Bottom 2.184: 95.76,85.85 95.76,83.58 Q12.S 95.16,79.34 | D13.C 95.16,76.8 95.16,79.34 | R32.1 114.72,78.83 Q11.S | v96.27,78.99 95.16,79.34 | v136.91,78.49 134.28,80.1 Q10.S
  Bottom 2.54: 135.38,85.34 134.28,84.24 Q10.S | Q11.S 115.06,83.32 115.06,95.25
  Bottom 3.81: 95.76,85.85 95.76,90.93 100.08,95.25 115.06,95.25 133.1,95.25 135.38,92.96 135.38,85.34
N$54
  Bottom 1.778: 109.22,70.36 109.47,70.61 F3.2A | F5.2A 130.56,70.61 129.38,71.79 129.18,71.79
  Bottom 2.54: Q12.D 89.66,79.25 | 129.29,78.23 129.03,78.49 129.03,83.57 128.78,83.31 Q10.D | Q11.D 109.22,70.36 108.97,70.1
  Bottom 3.81: 89.66,79.25 89.66,73.41 93.22,70.1 108.97,70.1 127.25,70.1 129.18,71.79 129.29,71.88 129.29,78.23
N$55  (via drill 1.6)
  Bottom 1.778: 36.2,92.08 35.31,92.96 20.32,92.96 18.8,91.44 18.8,72.14 18.54,71.88 18.54,70.38 R44.2
  Bottom 2.184: 35.81,91.69 34.96,89.57 Q15.S 34.96,75.53 36.41,75.12 | 74.93,86.11 73.57,84.75 Q13.S 74.42,82.13 v75.18,77.47 | 55.37,93.73 55.37,84.09 Q14.S 54.27,79.08 R33.2 | D9.A 36.41,75.12 | v36.07,78.74 36.67,77.88 36.41,75.12
  Bottom 3.81: 35.81,91.69 36.2,92.08 39.12,95 54.1,95 55.37,93.73 56.64,95 72.39,95 74.93,92.46 74.93,86.11
N$56
  Bottom 1.778: X7.4 105.16,349 104.14,350.01 C16.+ 104.14,356.87 | 103.38,363.22 Q4.D 103.38,357.63 104.14,356.87 | X7.5 107.95,345.19 107.95,353.06 104.14,356.87
N$57
  Bottom 1.778: F6.2A 30.55,70.43 31.12,70.43 | F7.2A 49.28,69.6 49.28,69.09
  Bottom 2.184: 68.58,76.2 68.07,76.71 Q13.D | Q14.D 48.77,69.09
  Bottom 2.54: Q15.D 29.46,78.49
  Bottom 3.81: 29.46,78.49 29.46,72.39 31.12,70.43 32.26,69.09 48.77,69.09 49.28,69.09 67.06,69.09 68.58,70.61 68.58,76.2
N$58
  Bottom 2.184: Q10.G 122.68,82.39 122.68,77.98 122.94,77.72 R18.1
N$59
  Bottom 2.184: Q11.G 102.87,82.13 R27.1
N$60
  Bottom 2.184: Q12.G 83.31,82.13 R28.1
N$61
  Bottom 2.184: Q13.G 61.72,82.13 R29.1
N$62
  Bottom 2.184: Q14.G 42.42,82.13 R30.1
N$63
  Bottom 2.184: Q15.G 23.11,82.13 R31.1
N$64
  Bottom 1.93: R31.2 22.35,61.72 24.38,59.69 34.8,59.69 37.21,62.1 | 37.21,62.1 37.34,62.23 40.13,62.23 40.26,62.1 | 40.26,62.1 42.67,59.69 55.12,59.69 56.26,60.83 | 56.26,60.83 56.77,61.34 | 56.77,61.34 59.44,64.01 R29.2 | D9.C 37.21,64.64 37.21,62.1 | R30.2 40.26,62.36 40.26,62.1 | R33.1 56.77,62.61 56.77,61.34 | R36.1 56.26,60.58 56.26,60.83
  Bottom 2.184: R31.2 22.35,62.99
N$65
  Bottom 1.93: R28.2 83.57,65.02 93.98,65.02 96.52,62.48 98.04,62.48 | 98.04,62.48 100.33,62.48 | 100.33,62.48 100.58,62.48 102.62,60.45 116.59,60.45 | 116.59,60.45 117.09,60.45 121.41,64.77 R18.2 | R32.2 116.59,60.45 | R27.2 100.33,62.48 | R34.1 100.08,62.23 100.33,62.48 | D13.A 98.04,63.75 98.04,62.48
N$66  (via drill 0.6)
  other vias: 38.1,52.32
N$67  (via drill 0.6)
  other vias: 57.91,51.82
N$68  (via drill 0.6)
  other vias: 101.6,51.82
N$69  (via drill 0.6)
  other vias: 121.41,53.09
N$70  (1 unrouted)
N$71  (1 unrouted)
N$72  (1 unrouted)
N$73  (1 unrouted)
  Bottom 1.676: R35.1 74.68,60.96
N$74  (1 unrouted)
  Bottom 1.676: 83.31,53.09 85.85,50.55 R37.1
N$75  (1 unrouted)
N$76  (4 unrouted)
  Bottom 1.676: D14.C 79.5,49.78 79.5,49.53 | 79.5,49.53 79.5,46.48 79.5,44.7 | 79.5,44.7 79.5,43.69 | 79.5,43.69 79.25,43.43 | R37.2 80.01,49.53 79.5,49.53 | 79.76,43.69 79.5,43.69 | 83.82,41.66 82.8,44.7 79.5,44.7
N$77  (1 unrouted)
  Bottom 1.676: R40.1 91.44,46.23 92.96,46.23 94.74,44.45 94.74,42.16
N$78  (1 unrouted)
N$79  (2 unrouted)
N$80  (1 unrouted)
N$81  (2 unrouted)
N$82  (via drill 0.6)
  other vias: 29.46,103.63
N$83  (via drill 0.6)
  other vias: 48.77,103.63
N$84  (via drill 0.6)
  other vias: 68.07,103.63
N$85  (via drill 0.6)
  other vias: 89.66,103.63
N$86  (via drill 0.6)
  other vias: 109.22,103.63
N$87  (via drill 0.6)
  other vias: 128.78,103.63
N$89  (3 unrouted)
  Bottom 1.676: 18.29,46.23 21.34,43.18
  Bottom 1.778: R44.1 18.29,54.84 18.29,46.23
N$90  (1 unrouted)
  Bottom 1.27: R49.1 53.86,29.46
  Bottom 1.676: 55.25,28.07 R49.1
N$91  (2 unrouted)
N$92  (3 unrouted)
  Bottom 1.422: 42.16,24.38 45.21,24.38
  Bottom 1.676: R50.1 42.16,24.38
  Bottom 1.778: R50.1 42.42,23.11 53.09,23.11 53.85,23.88 98.04,23.88 98.3,24.13 109.22,24.13 117.09,24.13 119.97,27.01
N$93  (2 unrouted)
N$94  (1 unrouted)
  Bottom 1.422: 44.07,29.72 44.07,30.61 44.07,31.12
  Bottom 1.676: 44.07,31.12 48.26,26.92 | 44.07,30.61 43.43,31.24 43.43,33.27 | 43.43,33.27 42.67,34.04 R50.2 | R51.1 44.96,33.27 43.43,33.27
N$95  (1 unrouted)
N$96  (1 unrouted)
N$97
  Bottom 1.778: 122.68,23.37 123.44,22.61
N$98  (1 unrouted)
  Bottom 0.406: D23.A 19.56,37.59 19.56,37.34
  Bottom 1.422: R54.2 16.51,39.49 D24.A
  Bottom 1.676: D24.A 19.3,37.34 19.56,37.34 23.88,37.34 D21.A
N$99  (1 unrouted)
  Bottom 1.422: R55.2 33.27,36.83 32.51,36.83 32.26,36.58 D25.C 30.48,37.08 D22.C
  Bottom 1.676: 32.51,36.83 34.04,36.83 34.42,37.21 | 34.42,37.21 35.31,38.1 | D20.C 34.42,37.21
N$100
  Bottom 1.676: D23.C 20.07,27.18 20.34,26.77 | 20.34,26.77 21.08,25.91 23.11,25.91 | 23.11,25.91 26.92,25.91 27.69,27.18 D22.A | 23.11,25.91 R53.1 22.61,24.96 22.61,24.64 20.07,24.64 18.8,25.91 C20.1 | 19.99,26.67 20.34,26.77
N$101
  Bottom 1.422: D24.C 16.26,29.97 16.26,23.88
  Bottom 1.676: 31.5,26.92 28.7,21.59 18.54,21.59 16.26,23.88 | 31.5,26.92 D25.A | 31.5,26.92 31.5,25.65 32.51,24.64 32.51,22.86 31.24,21.59 28.96,21.59 31,23.63 | 31,23.63 R52.1 | C19.1 31.24,24.38 31.24,23.88 31,23.63
N$102  (via drill 0.6)
  other vias: 105.16,12.95
N$103  (via drill 0.6)
  Bottom 1.422: 42.93,14.22 42.67,13.97 38.61,13.97 38.35,14.22 38.35,14.48 38.61,14.73
  Bottom 1.676: v98.04,12.95 92.71,18.29 56.9,18.29 55.88,17.27 45.97,17.27 42.93,14.22 | 40.18,14.22 R52.2 39.67,14.73 38.61,14.73
N$104
  Bottom 1.778: 147.32,14.48 147.83,14.48
N$105  (via drill 0.6)
  other vias: 81.53,11.68
N$106  (via drill 0.6)
  Bottom 1.676: v73.91,11.68 71.63,11.68 68.07,15.24 58.42,15.24 57.4,14.22 47.5,14.22 44.2,10.92 37.34,10.92 35.31,12.95 35.31,14.48 31.75,18.03 30.04,18.03 R53.2
N$108  (1 unrouted)
N$109  (4 unrouted)
  Bottom 1.676: 86.36,36.83 X10.1
(copper drawn outside any net)
  shapes: Bottom area x765, Bottom circle x26

### Text on the board
Bottom: CLASS-D V4 CPU | BEN PROVENZANO III | BEN PROVENZANO III | CLASS D V4